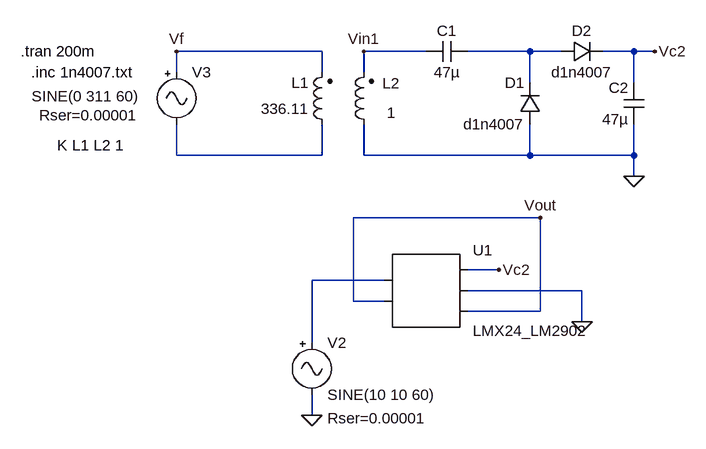
[diagram p0: schematic dobrador.asc]
dobrador.asc, the LTspice schematic file:
Version 4
SHEET 1 988 680
WIRE 192 96 -32 96
WIRE 352 96 256 96
WIRE 512 96 416 96
WIRE 560 96 512 96
WIRE 672 96 624 96
WIRE 704 96 672 96
WIRE -32 128 -32 96
WIRE 192 128 192 96
WIRE 256 128 256 96
WIRE 512 144 512 96
WIRE 672 144 672 96
WIRE -32 256 -32 208
WIRE 192 256 192 208
WIRE 192 256 -32 256
WIRE 256 256 256 208
WIRE 512 256 512 208
WIRE 512 256 256 256
WIRE 672 256 672 208
WIRE 672 256 512 256
WIRE 672 288 672 256
WIRE 528 352 240 352
WIRE 464 432 416 432
WIRE 288 448 176 448
WIRE 592 464 416 464
WIRE 240 480 240 352
WIRE 288 480 240 480
WIRE 528 496 528 352
WIRE 528 496 416 496
WIRE 592 512 592 464
WIRE 176 544 176 448
WIRE 176 656 176 624
FLAG -32 96 Vf
FLAG 256 96 Vin1
FLAG 672 288 0
FLAG 704 96 Vc2
FLAG 176 656 0
FLAG 592 512 0
FLAG 464 432 Vc2
FLAG 528 352 Vout
SYMBOL Misc\\signal -32 112 R0
WINDOW 123 0 0 Left 0
WINDOW 39 -212 82 Left 2
WINDOW 3 -223 53 Left 2
SYMATTR SpiceLine Rser=0.00001
SYMATTR Value SINE(0 311 60)
SYMATTR InstName V3
SYMBOL diode 528 208 R180
WINDOW 0 24 64 Left 2
WINDOW 3 24 0 Left 2
SYMATTR InstName D1
SYMATTR Value d1n4007
SYMBOL ind2 208 224 R180
WINDOW 0 36 80 Left 2
WINDOW 3 36 40 Left 2
SYMATTR InstName L1
SYMATTR Value 336.11
SYMATTR Type ind
SYMBOL ind2 272 224 R180
WINDOW 0 -40 79 Left 2
WINDOW 3 -33 34 Left 2
SYMATTR InstName L2
SYMATTR Value 1
SYMATTR Type ind
SYMBOL cap 416 80 R90
WINDOW 0 0 32 VBottom 2
WINDOW 3 32 32 VTop 2
SYMATTR InstName C1
SYMATTR Value 47µ
SYMBOL diode 560 112 R270
WINDOW 0 32 32 VTop 2
WINDOW 3 0 32 VBottom 2
SYMATTR InstName D2
SYMATTR Value d1n4007
SYMBOL cap 688 208 R180
WINDOW 0 24 56 Left 2
WINDOW 3 24 8 Left 2
SYMATTR InstName C2
SYMATTR Value 47µ
SYMBOL AutoGenerated\\LMX24_LM2902 352 464 R0
SYMATTR InstName U1
SYMBOL Misc\\signal 176 528 R0
WINDOW 123 0 0 Left 0
WINDOW 39 24 132 Left 2
SYMATTR InstName V2
SYMATTR Value SINE(10 10 60)
SYMATTR SpiceLine Rser=0.00001
TEXT -272 96 Left 2 !.tran 200m
TEXT -216 240 Left 2 !K L1 L2 1
TEXT -256 128 Left 2 !.inc 1n4007.txt

The netlist it stands for:
* dobrador.asc
V3 Vf N002 SINE(0 311 60) Rser=0.00001
D1 0 N001 d1n4007
L1 N002 Vf 336.11
L2 0 Vin1 1
C1 N001 Vin1 47µ
D2 N001 Vc2 d1n4007
C2 0 Vc2 47µ
* U1: LMX24_LM2902 (symbol AutoGenerated\LMX24_LM2902 not available, pins judged from their places): pin1=N003 pin2=Vout pin3=Vc2 pin4=0 pin5=Vout
V2 N003 0 SINE(10 10 60) Rser=0.00001
.model D D
.lib standard.dio
.tran 200m
K L1 L2 1
.inc 1n4007.txt
.backanno
.end